# EAGLE design dc-motor-driver (EAGLE 9.6.2)
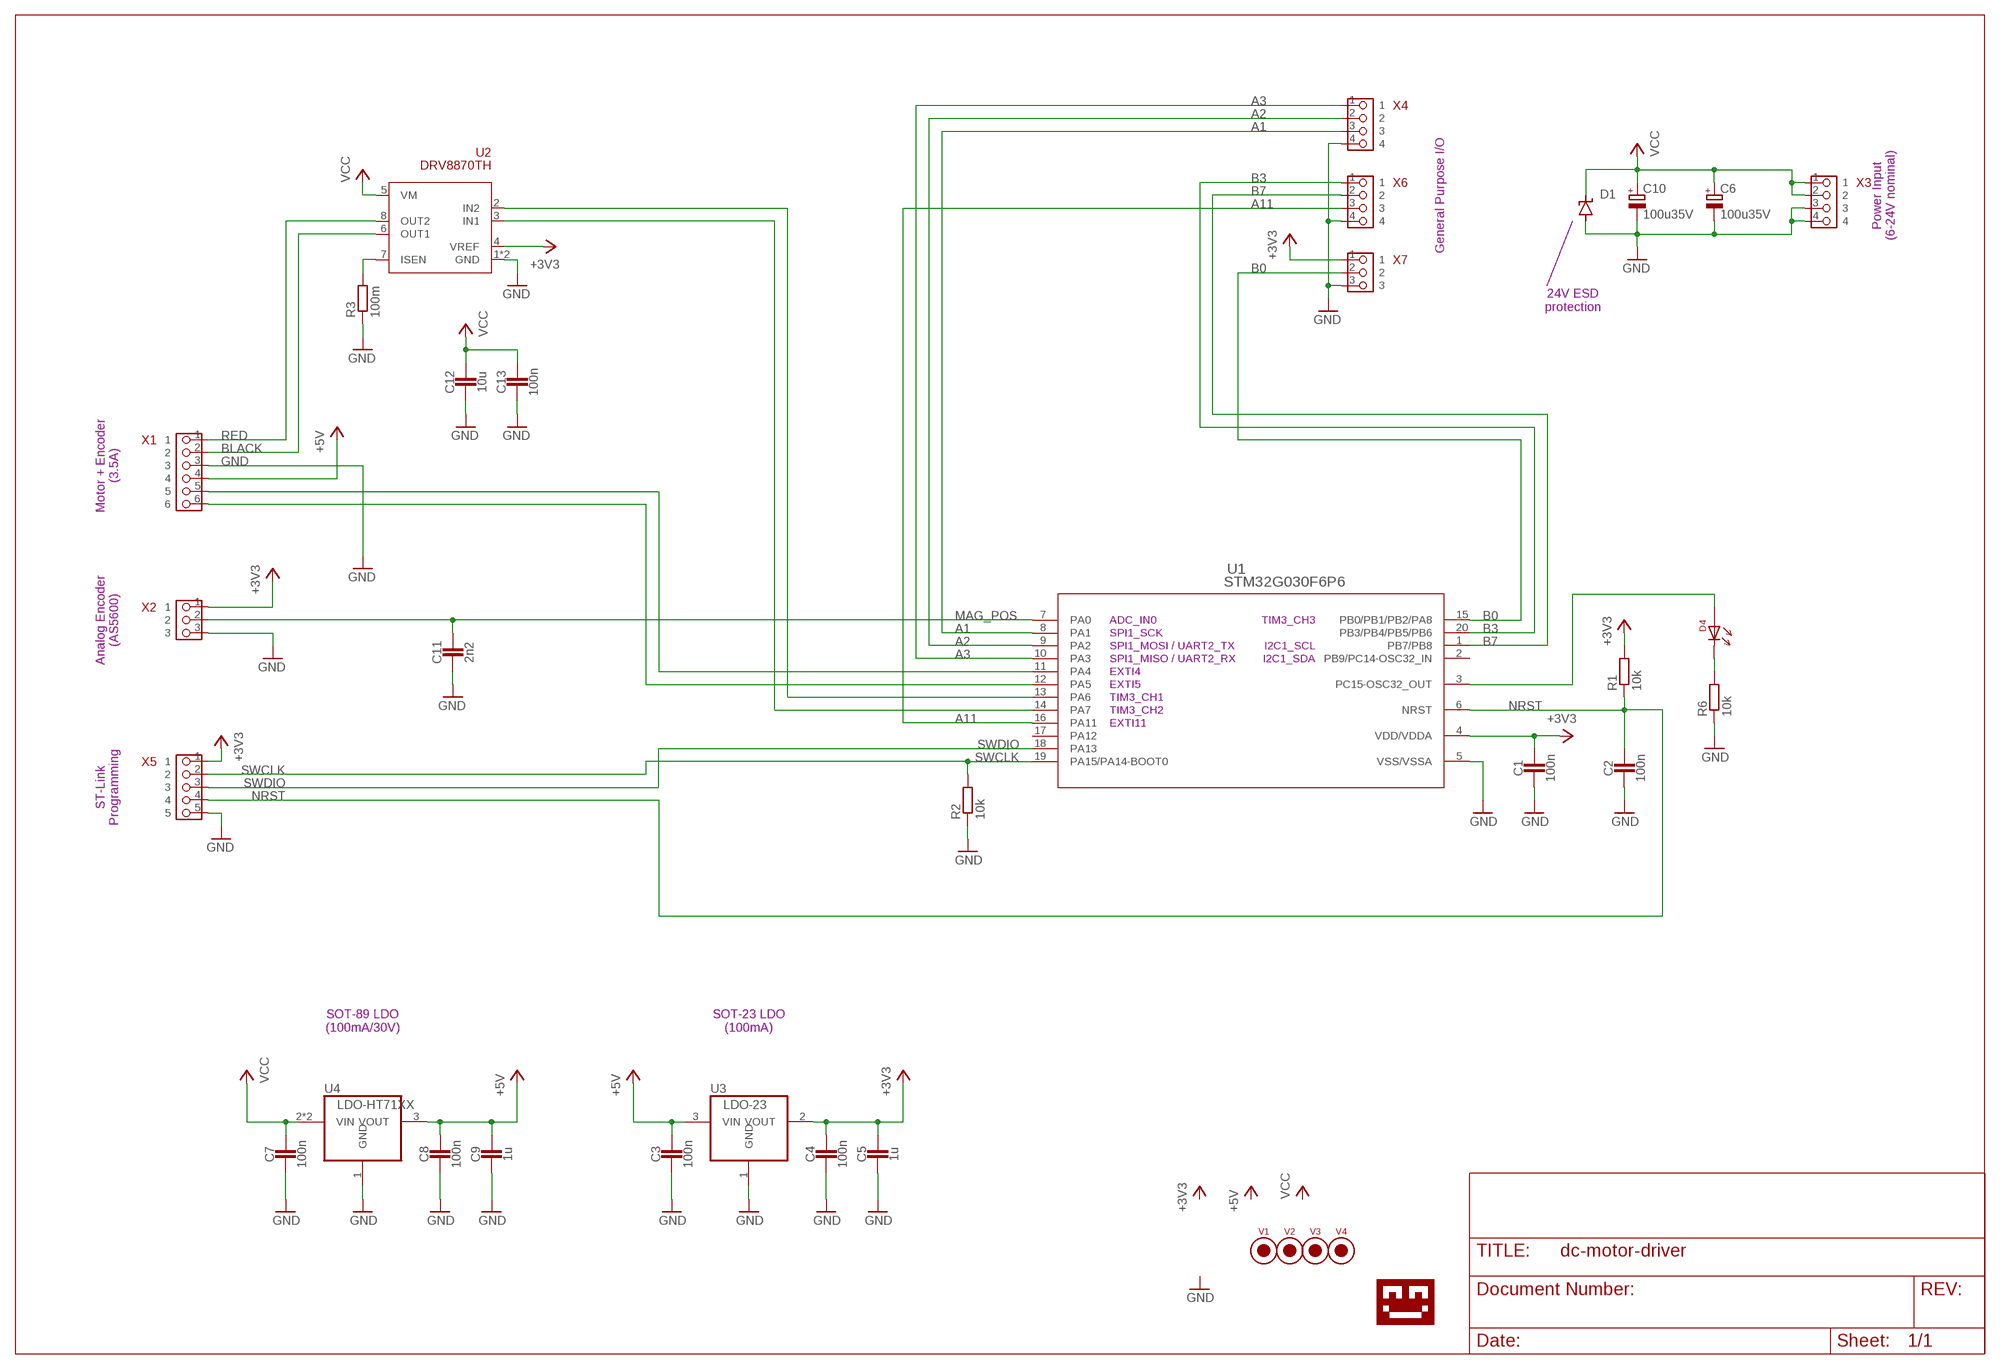
[diagram p0: schematic, sheet 1]

## Parts
C1  100n  CAPACITOR0603_CAP  [0603_CAP]
C2  100n  CAPACITOR0603_CAP  [0603_CAP]
C3  100n  CAPACITOR0603_CAP  [0603_CAP]
C4  100n  CAPACITOR0603_CAP  [0603_CAP]
C5  1u  CAPACITOR0603_CAP  [0603_CAP]
C6  100u35V  CPOL-EU153CLV-0605  [153CLV-0605]
C7  100n  CAPACITOR0603_CAP  [0603_CAP]
C8  100n  CAPACITOR0603_CAP  [0603_CAP]
C9  1u  CAPACITOR0603_CAP  [0603_CAP]
C10  100u35V  CPOL-EU153CLV-0605  [153CLV-0605]
C11  2n2  CAPACITOR0603_CAP  [0603_CAP]
C12  10u  CAPACITOR1206_CAP  [1206_CAP]
C13  100n  CAPACITOR0603_CAP  [0603_CAP]
D1  SUPPRESSOR-SMBJ  [SMBJ]
D4  LED-0805  [0805-DOT]
R1  10k  RESISTOR0603_RES  [0603-RES]
R2  10k  RESISTOR0603_RES  [0603-RES]
R3  100m  RESISTOR1206_RES_HIGH_CLEARANCE  [1206_RES_HIGH_CLEARANCE]
R6  10k  RESISTOR0603_RES  [0603-RES]
U1  STM32G030F6P6  [TSSOP20]
U2  DRV8870TH  [SOIC-8-THERM]
U3  LDO-23  [SOT-23]
U4  LDO-HT71XX  [SOT-89]
U$1  LOGO-TOBENG-4MM-FINISH  [TOBENG-4MM-FINISH]
V1  FIDUCIAL2MM  [FIDUCIAL_2MM]
V2  FIDUCIAL2MM  [FIDUCIAL_2MM]
V3  FIDUCIAL2MM  [FIDUCIAL_2MM]
V4  FIDUCIAL2MM  [FIDUCIAL_2MM]
X1  PIN_6X1HD  [PIN_6X1_HD]
X2  PIN_3X1HD  [PIN_3X1_HD]
X3  PIN_4X1HD  [PIN_4X1_HD]
X4  PIN_4X1HD  [PIN_4X1_HD]
X5  PIN_5X1HD  [PIN_5X1_HD]
X6  PIN_4X1HD  [PIN_4X1_HD]
X7  PIN_3X1HD  [PIN_3X1_HD]

## Nets
+3V3: C1.1 C4.1 C5.1 R1.2 U1.4(VDD/VDDA) U2.4(VREF) U3.2(VOUT) X2.1 X5.1 X7.1
+5V: C3.1 C8.1 C9.1 U3.3(VIN) U4.3(VOUT) X1.4
A1: U1.8(PA1) X4.3
A2: U1.9(PA2) X4.2
A3: U1.10(PA3) X4.1
A11: U1.16(PA11) X6.3
B0: U1.15(PB0/PB1/PB2/PA8) X7.2
B3: U1.20(PB3/PB4/PB5/PB6) X6.1
B7: U1.1(PB7/PB8) X6.2
BLACK: U2.6(OUT1) X1.2
D5: D4.1 U1.3(PC15-OSC32_OUT)
GND: C1.2 C2.2 C3.2 C4.2 C5.2 C6.- C7.2 C8.2 C9.2 C10.- C11.2 C12.2 C13.2 D1.A R2.1 R3.1 R6.1 U1.5(VSS/VSSA) U2.1(GND) U2.9(GND) U3.1(GND) U4.1(GND) X1.3 X2.3 X3.3 X3.4 X4.4 X5.5 X6.4 X7.3
M0U: U1.13(PA6) U2.2(IN2)
MAG_POS: C11.1 U1.7(PA0) X2.2
N$1: R3.2 U2.7(ISEN)
N$6: U1.14(PA7) U2.3(IN1)
N$13: D4.2 R6.2
N$24: U1.12(PA5) X1.6
N$25: U1.11(PA4) X1.5
NRST: C2.1 R1.1 U1.6(NRST) X5.4
RED: U2.8(OUT2) X1.1
SWCLK: R2.2 U1.19(PA15/PA14-BOOT0) X5.2
SWDIO: U1.18(PA13) X5.3
VCC: C6.+ C7.1 C10.+ C12.1 C13.1 D1.C U2.5(VM) U4.2(VIN) U4.2@1(VIN) X3.1 X3.2
Unconnected: U1.2(PB9/PC14-OSC32_IN) U1.17(PA12)

## Notes on the sheet
- General Purpose I/O
- Power Input
  (6-24V nominal)
- 24V ESD
  protection
- Motor + Encoder
  (3.5A)
- Analog Encoder
  (AS5600)
- ADC_IN0 | TIM3_CH3
- SPI1_SCK
- SPI1_MOSI / UART2_TX | I2C1_SCL
- SPI1_MISO / UART2_RX | I2C1_SDA
- EXTI4
- EXTI5
- TIM3_CH1
- TIM3_CH2
- EXTI11
- ST-Link
  Programming
- SOT-89 LDO
  (100mA/30V)
- SOT-23 LDO
  (100mA)

## Library data of the parts
C1-C5 C7-C9 C11-C13 = passives:CAPACITOR: SMD Capacitor
C6 C10 = resistor:CPOL-EU: POLARIZED CAPACITOR, European symbol
D1 = diode:SUPPRESSOR-: Suppressor diode
D4 = ftobler:LED
R1-R3 R6 = passives:RESISTOR: Resistor Basic schematic elements and footprints for 0201, 0402, 0603, 1206, and PTH resistors.
U1 = stm32:STM32G030F6P6; COPYRIGHT: Copyright (C) 2024 Ultra Librarian. All rights reserved.; MANUFACTURER_PART_NUMBER: STM32G030F6P6; MFR_NAME: STMicroelectronics
U2 = ftobler:DRV8870
U3 U4 = ftobler:LDO
U$1 = ftobler:LOGO
V1-V4 = ftobler:FIDUCIAL
X1 = ftobler-conn:PIN_6X1
X2 X7 = ftobler-conn:PIN_3X1
X3 X4 X6 = ftobler-conn:PIN_4X1
X5 = ftobler-conn:PIN_5X1

## Net classes
2 power: width 0.15 mm, clearance 0.2 mm to class 0, clearance 0.2 mm to class 1, clearance 0.2 mm

## Board
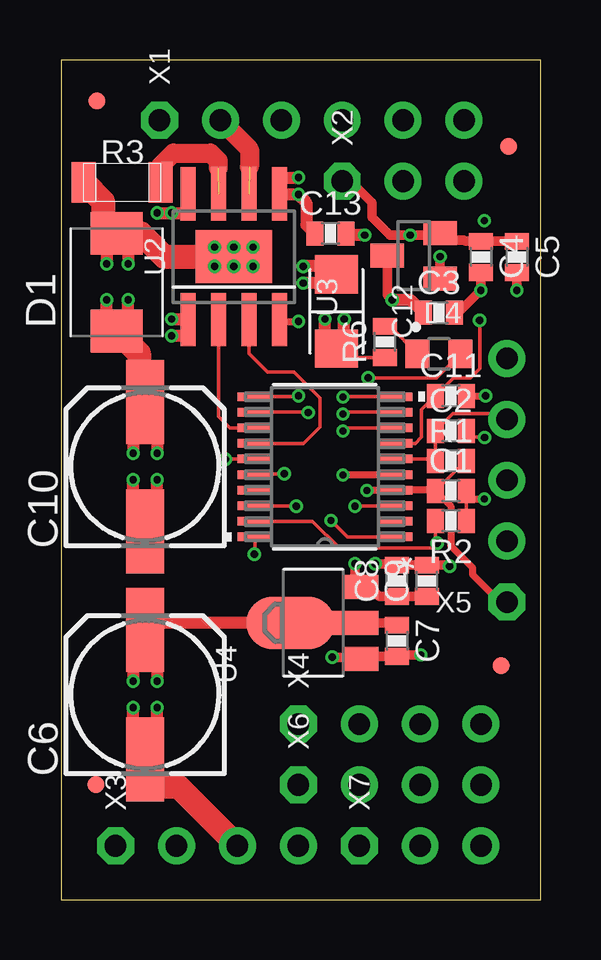
[diagram p1: board, top side]
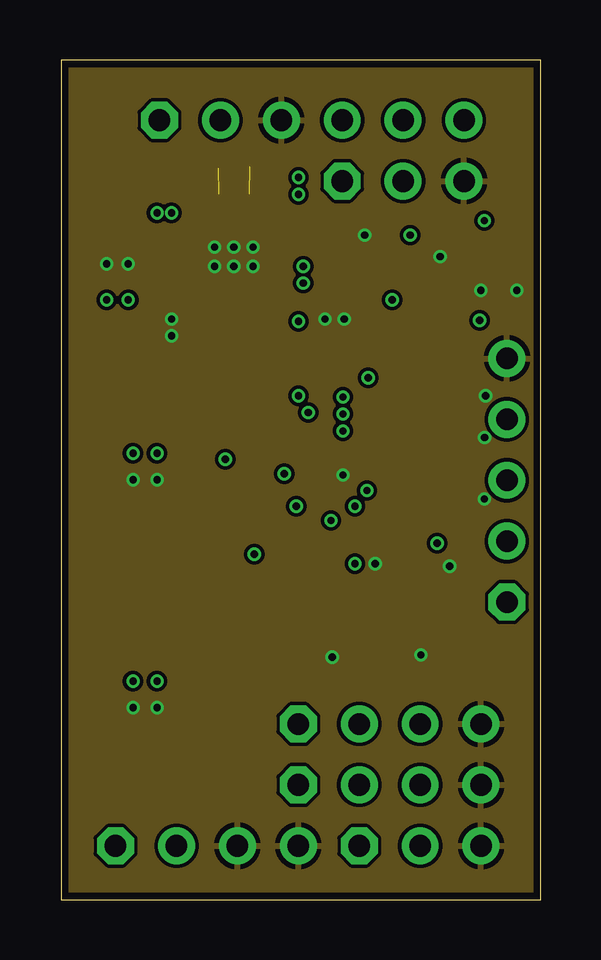
[diagram p2: board, inner layer Route2]
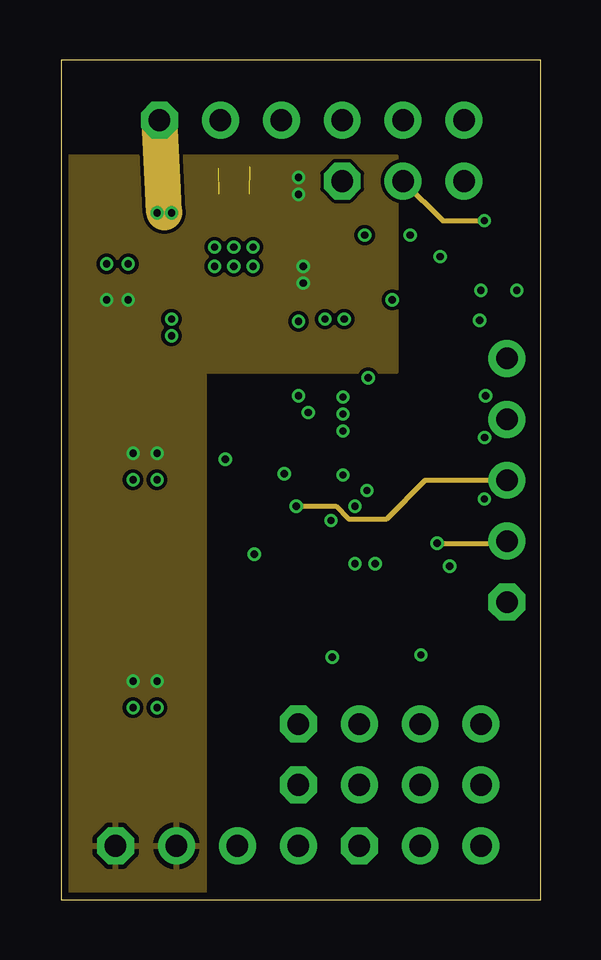
[diagram p3: board, inner layer Route15]
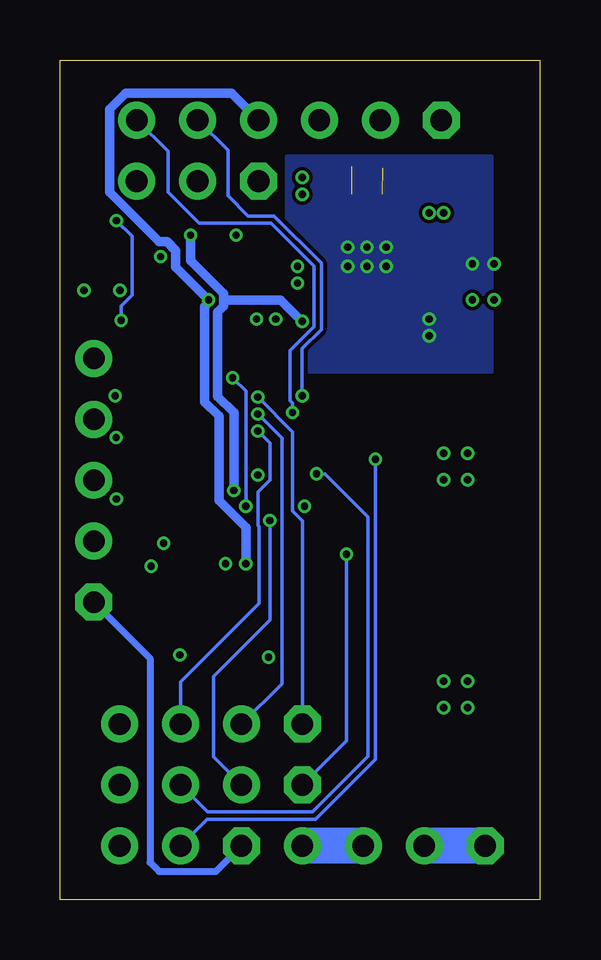
[diagram p4: board, bottom side, seen from below]

Size 20 x 35 mm. Coordinates in mm from the lower left corner, seen from the top.
Outline: 0,0 20,0 20,35 0,35 0,0
Copper layers (1+2*15+16): Top 0.035mm / dielectric 0.2mm / Route2 0.035mm / dielectric 0.4mm / Route15 0.035mm / dielectric 0.2mm / Bottom 0.035mm
Design rules "default *": minimum track width 0.15mm, minimum drill 0.2mm, track to track 0.15mm, track to pad 0.15mm, pad to pad 0.15mm, via to via 0.15mm, smd to smd 0.15mm, copper to edge 0.3mm, drill to drill 10mil, minimum pad ring 0.125mm, minimum via ring 0.125mm, stop-mask expansion 0.05mm, vias tented up to drill 0.3mm, thermal gap 0.2mm

### Footprints (pad centres in the part's own frame; a part is rotated, then mirrored left to right if it is on the bottom)
0603_CAP = smd 0.7 x 1: 1 -0.65,0; 2 0.65,0
153CLV-0605 = smd 3.5 x 1.6: + 2.7,0; - -2.7,0
1206_CAP = smd 1.6 x 1.8: 1 -1.55,0; 2 1.55,0
SMBJ = smd 1.78 x 2.16: A 2.04,0; C -2.03,0
0805-DOT = smd 1 x 1.2: 1 0.9,0; 2 -0.9,0
0603-RES = smd 0.7 x 1: 1 -0.65,0; 2 0.65,0
1206_RES_HIGH_CLEARANCE = smd 1 x 1.7: 1 -1.6,0; 2 1.6,0
TSSOP20 = smd 1.462 x 0.355: 1 -2.921,2.925; 2 -2.921,2.275; 3 -2.921,1.625; 4 -2.921,0.975; 5 -2.921,0.325; 6 -2.921,-0.325; 7 -2.921,-0.975; 8 -2.921,-1.625; 9 -2.921,-2.275; 10 -2.921,-2.925; 11 2.921,-2.925; 12 2.921,-2.275; 13 2.921,-1.625; 14 2.921,-0.975; 15 2.921,-0.325; 16 2.921,0.325; 17 2.921,0.975; 18 2.921,1.625; 19 2.921,2.275; 20 2.921,2.925
SOIC-8-THERM = smd 0.61 x 2.21: 1 -1.905,-2.616; 2 -0.635,-2.616; 3 0.635,-2.616; 4 1.905,-2.616; 5 1.905,2.616; 6 0.635,2.616; 7 -0.635,2.616; 8 -1.905,2.616 | smd 3.2 x 2.2: 9 0,0
SOT-23 = smd 1 x 1.4: 1 -0.95,-1.1; 2 0.95,-1.1; 3 0,1.1
SOT-89 = smd 1 x 1.5: 1 -1.499,-1.981; 3 1.499,-1.981 | smd 1 x 2: 2 0,-1.727 | smd 2.2 x 3.7: 2@1 0,0.94
FIDUCIAL_2MM = smd 0.7 x 0.7: V 0,0
PIN_6X1_HD = drill 0.9 pad 1.54 octagon: 1 0,0 | drill 0.9 pad 1.54: 2 0,-2.54; 3 0,-5.08; 4 0,-7.62; 5 0,-10.16; 6 0,-12.7
PIN_3X1_HD = drill 0.9 pad 1.54 octagon: 1 0,0 | drill 0.9 pad 1.54: 2 0,-2.54; 3 0,-5.08
PIN_4X1_HD = drill 0.9 pad 1.54 octagon: 1 0,0 | drill 0.9 pad 1.54: 2 0,-2.54; 3 0,-5.08; 4 0,-7.62
PIN_5X1_HD = drill 0.9 pad 1.54 octagon: 1 0,0 | drill 0.9 pad 1.54: 2 0,-2.54; 3 0,-5.08; 4 0,-7.62; 5 0,-10.16

### Placement (x,y rotation side)
C1  16.25,17.04 0 top
C2  16.25,19.54 0 top
C3  15.75,24.46 0 top
C4  17.5,26.79 270 top
C5  19,26.79 270 top
C6  3.5,8.54 90 top
C7  14,10.79 270 top
C8  14,13.29 90 top
C9  15.25,13.29 90 top
C10  3.5,18.04 90 top
C11  16.25,21 0 top
C12  11.48,24.52 270 top
C13  11.23,27.77 0 top
D1  2.32,25.73 90 top
D4  15.75,22.75 0 top
R1  16.25,18.29 0 top
R2  16.25,15.79 180 top
R3  2.55,29.9 0 top
R6  13.5,23.25 90 top
U1  11,18.04 180 top
U2  7.2,26.8 0 top
U3  14.7,26.84 90 top
U4  10.5,11.54 90 top
U$1  4,14.5 0 bottom
V1  1.5,33.3 0 top
V2  18.65,31.4 0 top
V3  18.35,9.75 0 top
V4  1.45,4.8 0 top
X1  4.1,32.49 90 top
X2  11.72,29.95 90 top
X3  2.27,2.24 90 top
X4  9.89,7.32 90 top
X5  18.59,12.4 180 top
X6  9.89,4.78 90 top
X7  12.43,2.24 90 top

### Tracks (layer width: path | path; a pad name or v marks a point on that pad's centre or on a via)
+3V3  (via drill 0.3 pad 0.45)
  Top 0.15: R1.2 16.85,18.29 C1.1
  Top 0.3: U2.4 9.19,24.1 v9.9,24.1 | v12.75,17.05 13.91,17.05 U1.4 15.57,17.07 C1.1 16.25,16.4 16.25,14.74 17.15,13.84 17.15,13.55 18.3,12.4 X5.1
  Top 0.4: C5.1 C4.1 16.86,27.44 16.8,27.5 16,27.5 15.8,27.7 | 15.8,27.7 U3.2 | X2.1 12.07,29.95 12.97,29.05 12.97,28.45 13.72,27.7 v14.55,27.7 15.8,27.7
  Bottom 0.3: X5.1 16.25,10.06 16.25,1.55 15.87,1.17 13.5,1.17 X7.1
  Bottom 0.4: v12.75,17.05 12.75,20.3 13.43,20.98 13.43,24.49 13.18,24.74 13.18,25 | 13.18,25 13.18,25.26 14.55,26.63 v14.55,27.7 | v9.9,24.1 10.8,25 13.18,25
+5V  (via drill 0.3 pad 0.45)
  Top 0.4: C9.1 C8.1 13.28,12.64 12.88,13.04 U4.3 12.25,13.27 v12.25,14 | v13.8,25 13.6,25.2 U3.3
  Top 0.5: C3.1 14.56,25 v13.8,25
  Bottom 0.4: X1.4 12.84,33.61 17.26,33.61 17.92,32.95 17.92,29.49 15.86,27.43 15.54,27.43 15.18,27.06 15.18,26.38 v13.8,25 13.8,24.89 13.97,24.72 13.97,20.75 13.38,20.15 13.38,16.64 12.25,15.52 v12.25,14
A1  (via drill 0.3 pad 0.45)
  Top 0.15: v11.75,19.54 11.88,19.66 U1.8
  Bottom 0.15: X4.3 14.97,9.08 11.7,12.35 11.7,15.54 11.75,15.59 11.75,16.99 11.25,17.49 11.25,19.04 v11.75,19.54
A2  (via drill 0.3 pad 0.45)
  Top 0.15: U1.9 11.82,20.32 v11.75,20.24
  Bottom 0.15: v11.75,20.24 10.75,19.24 10.75,9 X4.2
A3  (via drill 0.3 pad 0.45)
  Top 0.15: U1.10 11.77,20.96 v11.75,20.95
  Bottom 0.15: X4.1 9.89,15.78 10.3,16.19 10.3,19.5 v11.75,20.95
A11  (via drill 0.3 pad 0.45)
  Top 0.15: U1.16 8.11,17.75 v9.3,17.75
  Bottom 0.15: X6.3 13.84,3.65 9.47,3.65 7.15,5.97 7.15,15.95 8.18,16.98 8.95,17.75 v9.3,17.75
B0  (via drill 0.3 pad 0.45)
  Top 0.15: v6.85,18.35 6.87,18.36 U1.15
  Bottom 0.15: X7.2 13.86,3.35 9.35,3.35 6.85,5.85 v6.85,18.35
B3  (via drill 0.3 pad 0.45)
  Top 0.15: U1.20 8.08,14.43 v8.05,14.4
  Bottom 0.15: X6.1 8.05,6.62 v8.05,14.4
B7  (via drill 0.3 pad 0.45)
  Top 0.15: v11.25,15.8 11.94,15.12 U1.1
  Bottom 0.15: X6.2 13.6,5.95 13.6,9.3 11.25,11.65 v11.25,15.8
BLACK  (1 unrouted)
  Top 0.8: X1.2 7.85,31.28 7.85,30.55
D5  (via drill 0.3 pad 0.45)
  Top 0.15: U1.3 12.27,16.41 v12.25,16.4 | D4.1 15.65,21.75 v12.8,21.75
  Bottom 0.15: v12.8,21.75 12.25,21.2 v12.25,16.4
GND  (via drill 0.3 pad 0.45)
  Top 0.15: R6.1 11.85,22.6 C12.2 | C2.2 17.15,19.29 17.63,19.29 v17.66,19.26 | C1.2 R2.1
  Top 0.3: C1.2 16.9,16.84 17.04,16.7 v17.65,16.7 | C11.2 v17.7,21 | U1.5 13.91,17.7 v11.75,17.7 | U2.9 v7.2,26.4
  Top 0.4: C4.2 v17.5,25.4 16.56,24.46 C3.2 | C5.2 v19,25.4 | v15.8,26.8 U3.1 | v11.3,10.1 12.42,10.1 U4.1 12.58,10.14 C7.2 14.06,10.2 v15,10.2 | v13.1,14 13.94,14 C8.2 C9.2 16.16,13.94 v16.2,13.9
  Top 0.5: 6.57,27.43 U2.9 | v11.8,24.2 11.8,23.29 C12.2 11,23.45 v11,24.2 | v1.9,26.5 1.9,27.35 D1.A 2.8,27.29 v2.8,26.5 | v4.6,24.2 5.1,24.2 5.19,24.29 U2.1 5.29,23.5 v4.6,23.5 | v3,17.5 3,15.84 C10.- 4,15.84 v4,17.5 | v4,8 4,6.34 C6.- 3,6.34 v3,8 | v12.66,27.7 11.96,27.7 11.88,27.62 | C13.2 11.88,27.62 | 11.88,27.62 11.85,27.6
  Top 1: R3.1 1.75,29.1 1.75,28 1.98,27.77 D1.A 3.33,27.77 4.3,26.8 U2.9 | X3.3 4.89,4.7 3.5,4.7 3.4,4.8 3.4,5.74 C6.-
  Bottom 1.5: X3.3 X3.4
  other vias: 7.2,27.2 8,27.2 6.4,27.2 8,26.4 6.4,26.4
  pour Route2: -1,36 21,36 21,-1 -1,-1
  pour Bottom: 2,31 10.55,31 10.55,22 2,22
M0U
  Top 0.15: U2.2 6.57,20.14 7.04,19.66 U1.13
MAG_POS  (via drill 0.3 pad 0.45)
  Top 0.15: U1.7 14.77,19.02 15.03,19.27 15.03,20.43 C11.1 16.35,21.75 17.07,21.75 17.45,22.13 v17.45,24.15
  Route15 0.2: X2.2 15.91,28.3 v17.65,28.3
  Bottom 0.15: v17.45,24.15 17.45,24.74 17,25.19 17,27.65 v17.65,28.3
N$1  (1 unrouted)
  Top 0.8: R3.2 4.15,30.6 4.67,31.12 6.23,31.12 6.55,30.8 6.55,30.5
N$6
  Top 0.15: U1.14 10.12,19.02 10.8,19.7 10.8,20.9 9.7,22 8.6,22 7.83,22.77 U2.3
N$13
  Top 0.15: R6.2 13.7,23.9 D4.2
N$24  (via drill 0.3 pad 0.45)
  Top 0.15: U1.12 10.29,20.32 v10.3,20.3
  Bottom 0.15: v10.3,20.3 10.3,20.69 10.4,20.79 10.4,22.89 9.4,23.89 9.4,26.41 11.19,28.2 14.2,28.2 15.5,29.5 15.5,31.19 X1.6
N$25  (via drill 0.3 pad 0.45)
  Top 0.15: U1.11 9.87,20.96 v9.9,21
  Bottom 0.15: X1.5 13,31.23 13,29.35 12.15,28.5 11.07,28.5 9.1,26.53 9.1,23.77 9.9,22.97 v9.9,21
NRST
  Top 0.15: U1.6 15.53,18.36 R1.1 C2.1 16.32,20.27 18.34,20.27 X5.4
RED  (via drill 0.3 pad 0.45)
  Top 0.5: U2.8 5.3,28.73 5.2,28.63 5.2,28.62 v4.6,28.62 v4,28.62
  Route15 0.5: v4.6,28.62 4.3,28.65
  Route15 1.5: 4.3,28.65 4.23,30 X1.1
SWCLK  (via drill 0.3 pad 0.45)
  Top 0.15: R2.2 15.6,14.93 v15.68,14.85 15.47,14.65 11.6,14.65 10.48,15.77 U1.19
  Route15 0.2: v15.68,14.85 18.5,14.85 X5.2
SWDIO  (via drill 0.3 pad 0.45)
  Top 0.15: U1.18 9.79,16.41 v9.8,16.4
  Route15 0.2: v9.8,16.4 11.45,16.4 11.97,15.88 13.57,15.88 15.18,17.48 X5.3
VCC  (via drill 0.3 pad 0.45)
  Top 0.4: C7.1 13.9,11.54 U4.2 U4.2@1
  Top 0.5: U2.5 9.86,29.42 9.89,29.39 | 9.89,29.39 v9.9,29.4 | U2.5 9.17,29.48 | 9.2,30 9.11,29.91 U2.5 | U2.5 9.11,30.2 9.1,30.2 | U2.5 9.11,30.1 v9.9,30.1 | C13.1 10.23,28.12 10.23,29.04 9.89,29.39 | v10.1,25.7 11.11,25.7 C12.1 11.15,26.4 v10.1,26.4 | v1.9,25 1.9,24.12 D1.C 2.8,24.18 v2.8,25 | v4,18.6 4,20.24 C10.+ 3,20.24 v3,18.6 | C6.+ 4,10.74 v4,9.1 | C6.+ 3,10.74 v3,9.1 | U4.2@1 3.8,11.54 C6.+
  Top 1: D1.C 3.25,22.77 3.25,21.25 3.55,20.95 3.55,20.79 C10.+
  Bottom 1.5: X3.1 X3.2
  pour Route15: 6,-1 6,22 14,22 14,31 -1,31 -1,-1

### Text on the board
tStop: M+ | M- | GND | +5V | enc_A | enc_B | V2 | V1 | +3.3V | POS | GND | GND | NRST | SWDIO | SWCLK | +3V3 | V3 | V4 | A3 | A2 | A1 | GND | B3 | B7 | A11 | GND | VCC | VCC | GND | GND | +3V3 | B0 | GND
tFinish: + | + | JLCJLCJLCJLC
bFinish: rd | bk | gn | bl | ye | wh | 3V | an | G | G | R | pcb-dc-motor-driver / v1 by ftobler / 2024 | D | C | A3 | A2 | A1 | G | 3 | B3 | B7 | A11 | G | + | + | G | G | 3V | B0 | G